# Altium schematic sheet STP_MAX96724_PINOUT.SchDoc
size D; SheetNumber: 4; SheetTotal: 19
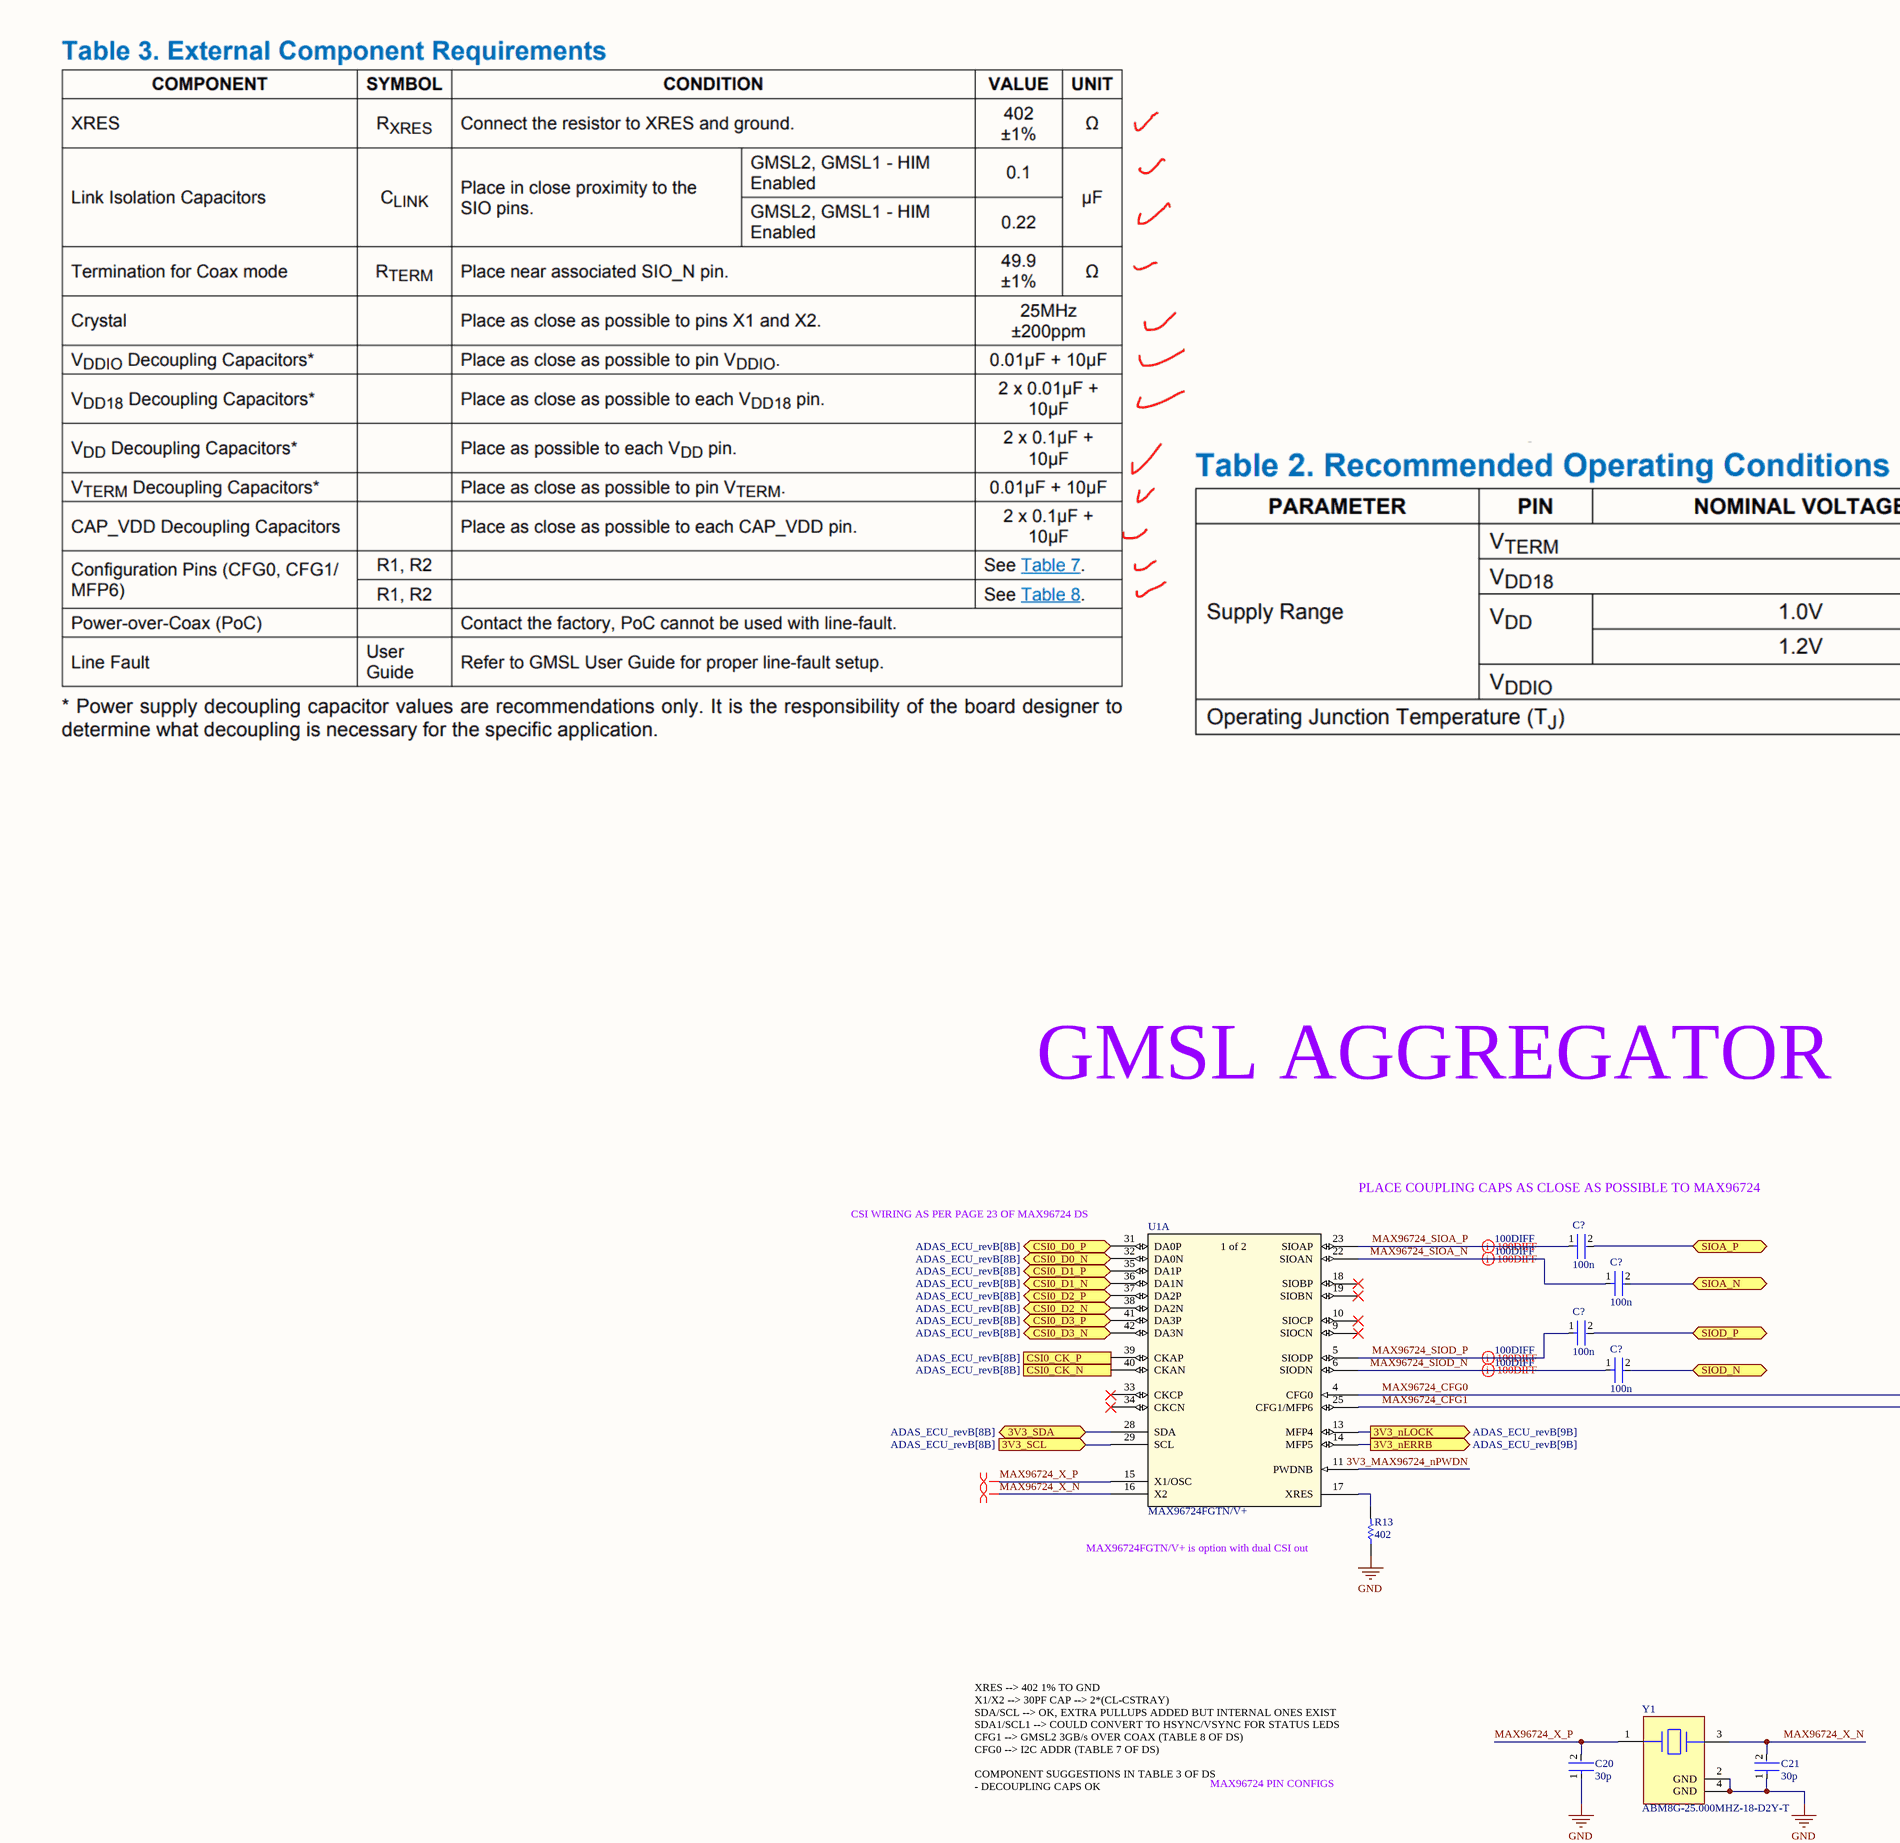
[diagram p0: STP_MAX96724_PINOUT.SchDoc, top left]
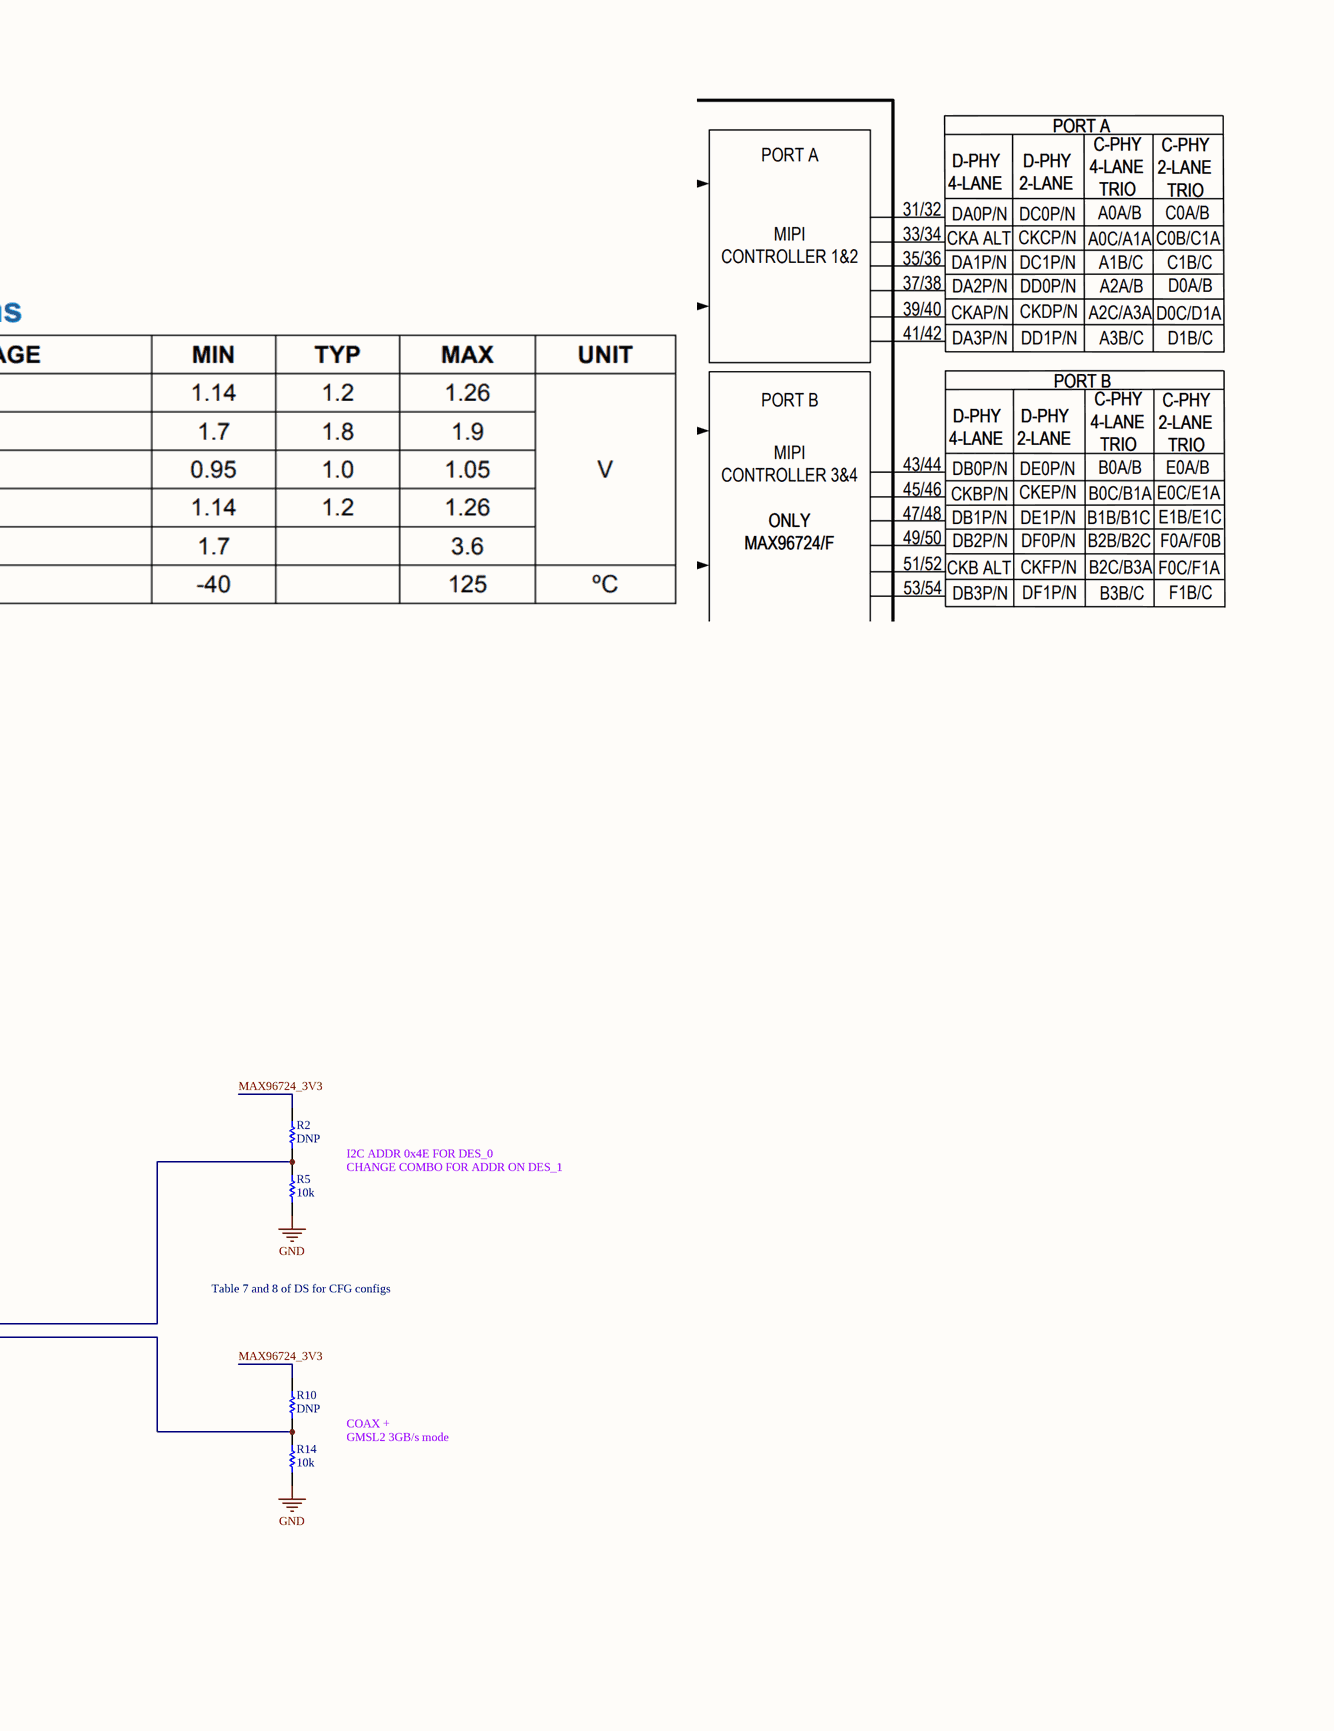
[diagram p1: STP_MAX96724_PINOUT.SchDoc, top right]
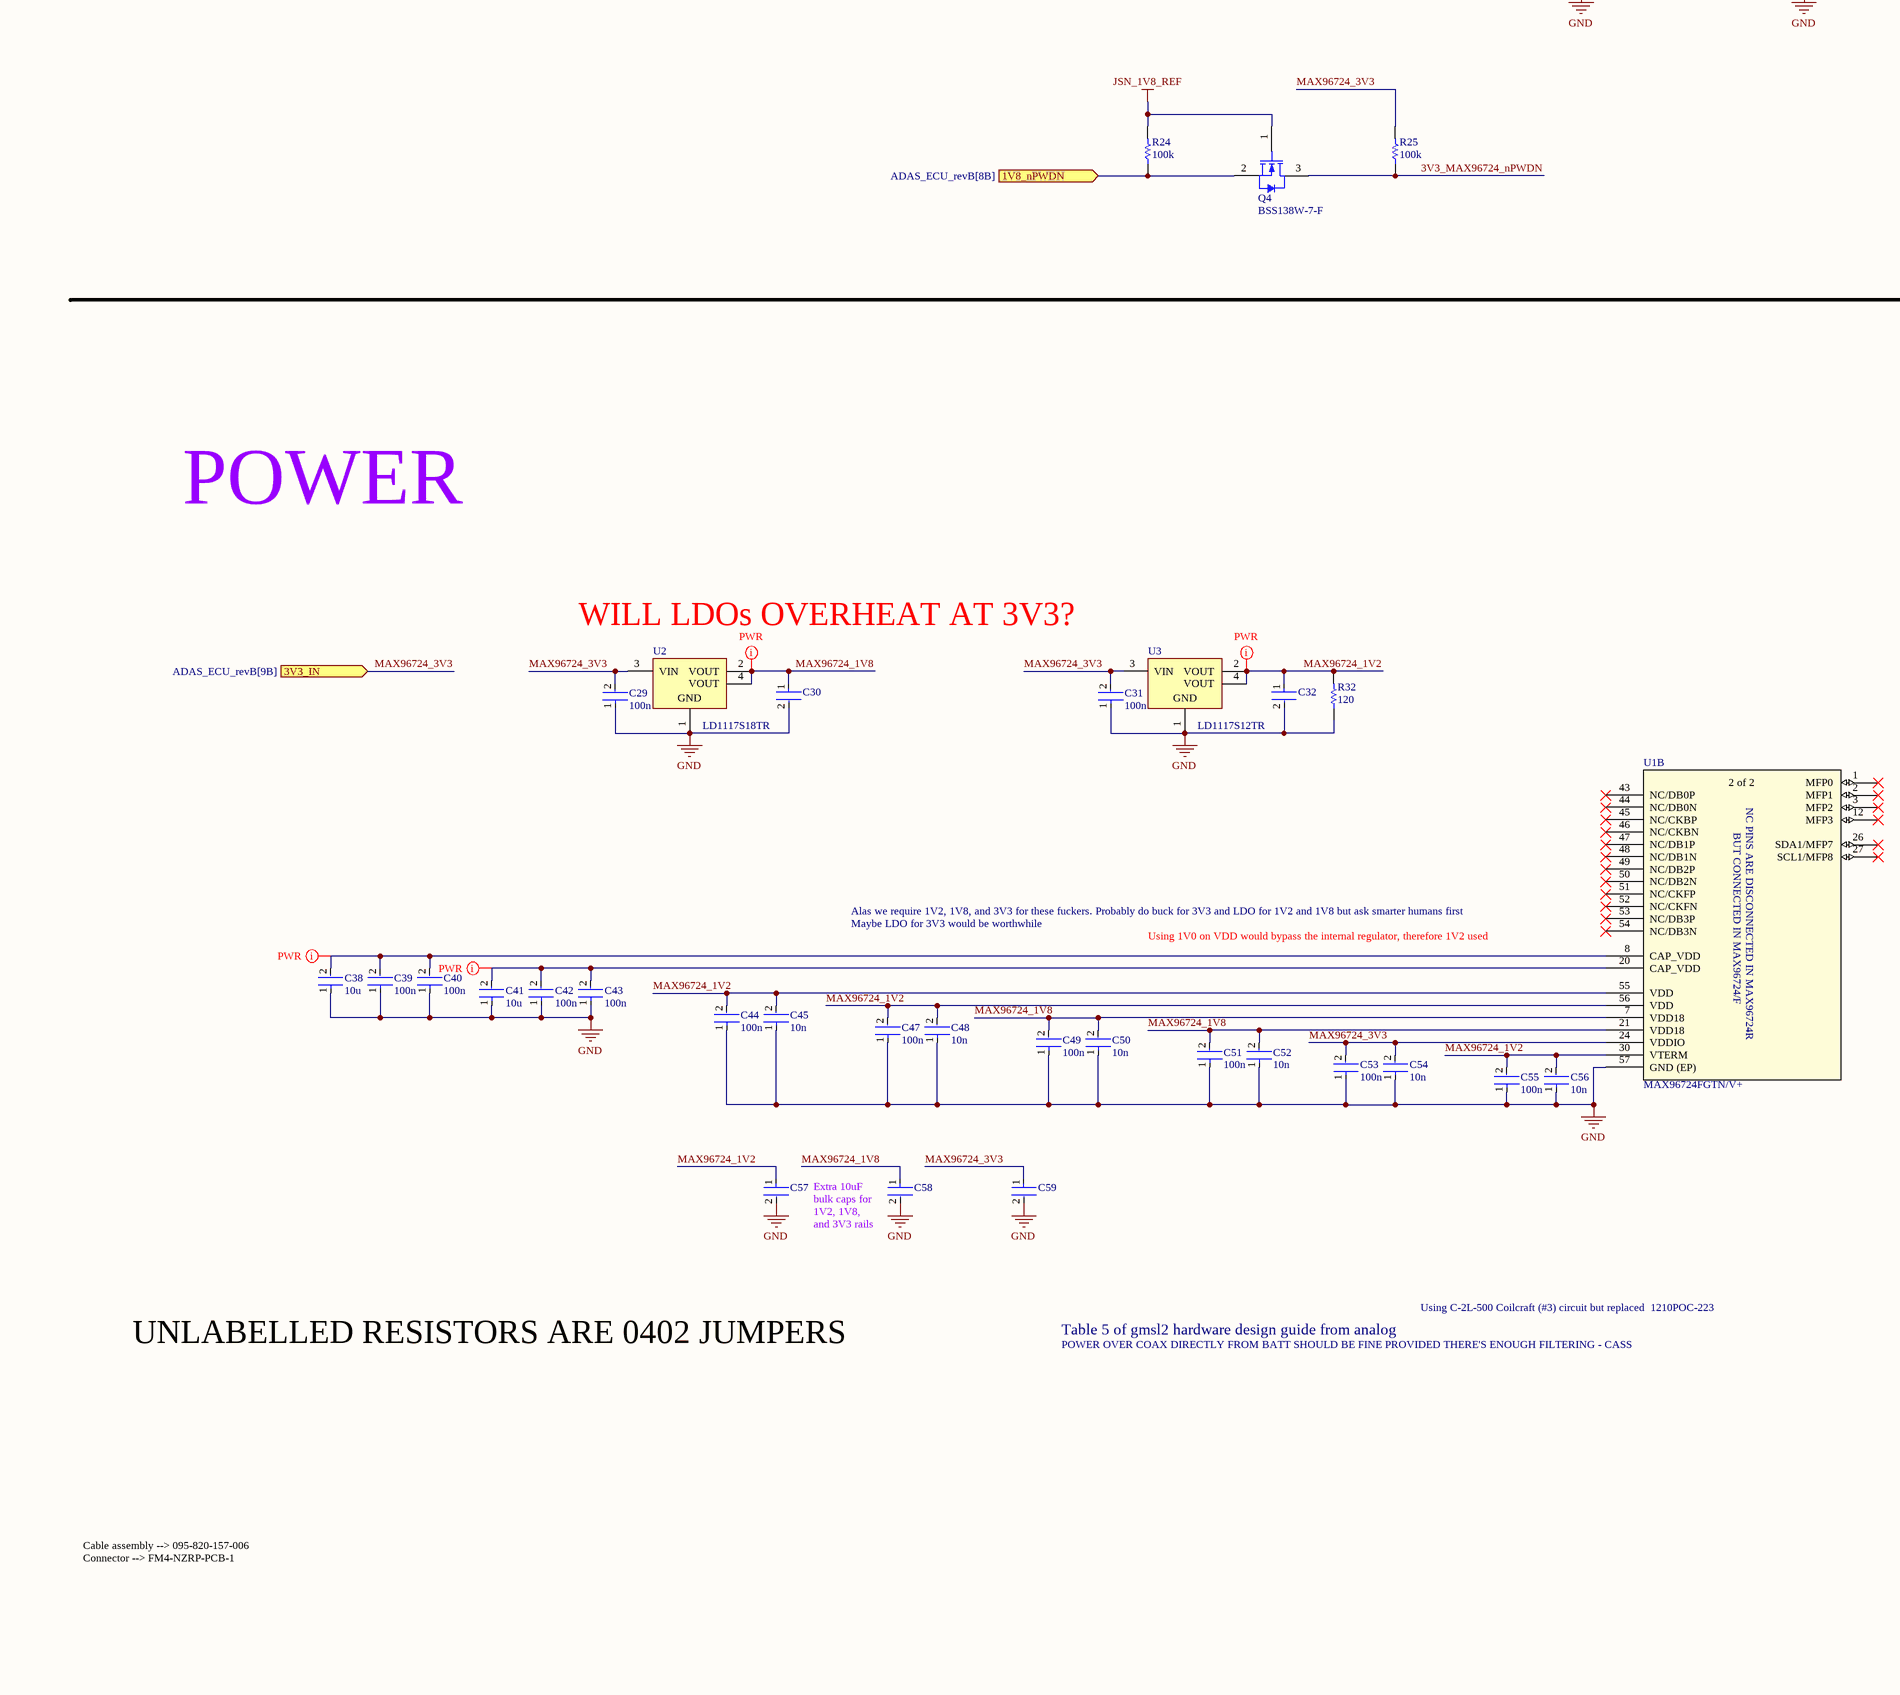
[diagram p2: STP_MAX96724_PINOUT.SchDoc, bottom left]
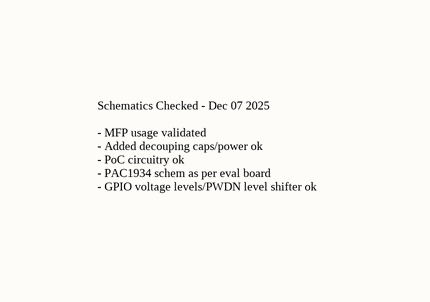
[diagram p3: STP_MAX96724_PINOUT.SchDoc, bottom right]

## Parts
(Parts that share a designator on the sheet are numbered #1, #2 ... from top to bottom, then left to right.)
C20  30p  [FP-0402-L_1_0_0_05-W_0_5-IPC_A]
C21  30p  [FP-0402-L_1_0_0_05-W_0_5-IPC_A]
C29  100n  [FP-0402-L_1_0_0_05-W_0_5-IPC_A]
C30  GRM188R60J106ME47D  [FP-GRM188-0_1-e0_2_0_55-IPC_A]  (value not drawn)
C31  100n  [FP-0402-L_1_0_0_05-W_0_5-IPC_A]
C32  GRM188R60J106ME47D  [FP-GRM188-0_1-e0_2_0_55-IPC_A]  (value not drawn)
C38  10u  [FP-0402-L_1_0_0_05-W_0_5-IPC_A]
C39  100n  [FP-0402-L_1_0_0_05-W_0_5-IPC_A]
C40  100n  [FP-0402-L_1_0_0_05-W_0_5-IPC_A]
C41  10u  [FP-0402-L_1_0_0_05-W_0_5-IPC_A]
C42  100n  [FP-0402-L_1_0_0_05-W_0_5-IPC_A]
C43  100n  [FP-0402-L_1_0_0_05-W_0_5-IPC_A]
C44  100n  [FP-0402-L_1_0_0_05-W_0_5-IPC_A]
C45  10n  [FP-0402-L_1_0_0_05-W_0_5-IPC_A]
C47  100n  [FP-0402-L_1_0_0_05-W_0_5-IPC_A]
C48  10n  [FP-0402-L_1_0_0_05-W_0_5-IPC_A]
C49  100n  [FP-0402-L_1_0_0_05-W_0_5-IPC_A]
C50  10n  [FP-0402-L_1_0_0_05-W_0_5-IPC_A]
C51  100n  [FP-0402-L_1_0_0_05-W_0_5-IPC_A]
C52  10n  [FP-0402-L_1_0_0_05-W_0_5-IPC_A]
C53  100n  [FP-0402-L_1_0_0_05-W_0_5-IPC_A]
C54  10n  [FP-0402-L_1_0_0_05-W_0_5-IPC_A]
C55  100n  [FP-0402-L_1_0_0_05-W_0_5-IPC_A]
C56  10n  [FP-0402-L_1_0_0_05-W_0_5-IPC_A]
C57  EMK107BBJ106MA-T  [FP-0603-L_1_6_0_2-W_0_8_0-MFG]  (value not drawn)
C58  EMK107BBJ106MA-T  [FP-0603-L_1_6_0_2-W_0_8_0-MFG]  (value not drawn)
C59  EMK107BBJ106MA-T  [FP-0603-L_1_6_0_2-W_0_8_0-MFG]  (value not drawn)
C?#1  100n  [FP-0402-L_1_0_0_05-W_0_5-IPC_A]
C?#2  100n  [FP-0402-L_1_0_0_05-W_0_5-IPC_A]
C?#3  100n  [FP-0402-L_1_0_0_05-W_0_5-IPC_A]
C?#4  100n  [FP-0402-L_1_0_0_05-W_0_5-IPC_A]
Q4  BSS138W-7-F  [DIOD-SOT323-3_V]
R2  DNP  [R0603B]
R5  10k  [R0603B]
R10  DNP  [R0603B]
R13  402  [R0603B]
R14  10k  [R0603B]
R24  100k  [R0603B]
R25  100k  [R0603B]
R32  120  [R0603B]
U1  MAX96724FGTN/V+  [MAX96724FGTN_V+-Footprint-1]  (parts A,B of 2)
U2  LD1117S18TR  [SOT-223_M]
U3  LD1117S12TR  [SOT-223_M]
Y1  ABM8G-25.000MHZ-18-D2Y-T  [FP-ABM8G-MFG]

## Ports
1V8_nPWDN (in, see ADAS_ECU_revB[8B]), 3V3_IN (in, see ADAS_ECU_revB[9B]), 3V3_nERRB (out, see ADAS_ECU_revB[9B]), 3V3_nLOCK (out, see ADAS_ECU_revB[9B]), 3V3_SCL (in, see ADAS_ECU_revB[8B]), 3V3_SDA (bidir, see ADAS_ECU_revB[8B]), CSI0_CK_N (in, see ADAS_ECU_revB[8B]), CSI0_CK_P (in, see ADAS_ECU_revB[8B]), CSI0_D0_N (bidir, see ADAS_ECU_revB[8B]), CSI0_D0_P (bidir, see ADAS_ECU_revB[8B]), CSI0_D1_N (bidir, see ADAS_ECU_revB[8B]), CSI0_D1_P (bidir, see ADAS_ECU_revB[8B]), CSI0_D2_N (bidir, see ADAS_ECU_revB[8B]), CSI0_D2_P (bidir, see ADAS_ECU_revB[8B]), CSI0_D3_N (bidir, see ADAS_ECU_revB[8B]), CSI0_D3_P (bidir, see ADAS_ECU_revB[8B]), SIOA_N (bidir), SIOA_P (bidir), SIOD_N (bidir), SIOD_P (bidir)

## Nets
GND: C20.1 C21.1 C29.1 C30.2 C31.1 C32.2 C38.1 C39.1 C40.1 C41.1 C42.1 C43.1 C44.1 C45.1 C47.1 C48.1 C49.1 C50.1 C51.1 C52.1 C53.1 C54.1 C55.1 C56.1 C57.2 C58.2 C59.2 R5.1 R13.1 R14.1 R32.1 U1.57(GND_(EP)) U2.1(GND) U3.1(GND) Y1.2(GND) Y1.4(GND)
JSN_1V8_REF: Q4.1(G) R24.2
1V8_nPWDN: Q4.2(S) R24.1 ; port 1V8_nPWDN
3V3_MAX96724_nPWDN: Q4.3(D) R25.1 U1.11(PWDNB)
3V3_nERRB: U1.14(MFP5) ; port 3V3_nERRB
3V3_nLOCK: U1.13(MFP4) ; port 3V3_nLOCK
3V3_SCL: U1.29(SCL) ; port 3V3_SCL
3V3_SDA: U1.28(SDA) ; port 3V3_SDA
CSI0_CK_N: U1.40(CKAN) ; port CSI0_CK_N
CSI0_CK_P: U1.39(CKAP) ; port CSI0_CK_P
CSI0_D0_N: U1.32(DA0N) ; port CSI0_D0_N
CSI0_D0_P: U1.31(DA0P) ; port CSI0_D0_P
CSI0_D1_N: U1.36(DA1N) ; port CSI0_D1_N
CSI0_D1_P: U1.35(DA1P) ; port CSI0_D1_P
CSI0_D2_N: U1.38(DA2N) ; port CSI0_D2_N
CSI0_D2_P: U1.37(DA2P) ; port CSI0_D2_P
CSI0_D3_N: U1.42(DA3N) ; port CSI0_D3_N
CSI0_D3_P: U1.41(DA3P) ; port CSI0_D3_P
MAX96724_1V2: C32.1 C44.2 C45.2 C47.2 C48.2 C55.2 C56.2 C57.1 R32.2 U1.30(VTERM) U1.55(VDD) U1.56(VDD) U3.2(VOUT) U3.4(VOUT)
MAX96724_1V8: C30.1 C49.2 C50.2 C51.2 C52.2 C58.1 U1.7(VDD18) U1.21(VDD18) U2.2(VOUT) U2.4(VOUT)
MAX96724_3V3: C29.2 C31.2 C53.2 C54.2 C59.1 R2.2 R10.2 R25.2 U1.24(VDDIO) U2.3(VIN) U3.3(VIN) ; port 3V3_IN
MAX96724_CFG0: R2.1 R5.2 U1.4(CFG0)
MAX96724_CFG1: R10.1 R14.2 U1.25(CFG1/MFP6)
MAX96724_SIOA_N: C?#2.1 U1.22(SIOAN)
MAX96724_SIOA_P: C?#1.1 U1.23(SIOAP)
MAX96724_SIOD_N: C?#4.1 U1.6(SIODN)
MAX96724_SIOD_P: C?#3.1 U1.5(SIODP)
MAX96724_X_N: C21.2 U1.16(X2) Y1.3
MAX96724_X_P: C20.2 U1.15(X1/OSC) Y1.1
SIOA_N: C?#2.2 ; port SIOA_N
SIOA_P: C?#1.2 ; port SIOA_P
SIOD_N: C?#4.2 ; port SIOD_N
SIOD_P: C?#3.2 ; port SIOD_P
NetC38_2: C38.2 C39.2 C40.2 U1.8(CAP_VDD)
NetC41_2: C41.2 C42.2 C43.2 U1.20(CAP_VDD)
NetR13_2: R13.2 U1.17(XRES)

Not connected (* = marked no-connect by the designer): U1 1(MFP0)* 2(MFP1)* 3(MFP2)* 9(SIOCN)* 10(SIOCP)* 12(MFP3)* 18(SIOBP)* 19(SIOBN)* 26(SDA1/MFP7)* 27(SCL1/MFP8)* 33(CKCP)* 34(CKCN)* 43(NC/DB0P)* 44(NC/DB0N)* 45(NC/CKBP)* 46(NC/CKBN)* 47(NC/DB1P)* 48(NC/DB1N)* 49(NC/DB2P)* 50(NC/DB2N)* 51(NC/CKFP)* 52(NC/CKFN)* 53(NC/DB3P)* 54(NC/DB3N)*

## Layout directives
differential pair: MAX96724_X_N, MAX96724_X_P
differential pair; differential pair class 100DIFF: MAX96724_SIOA_N, MAX96724_SIOA_P, MAX96724_SIOD_N, MAX96724_SIOD_P
net class PWR: MAX96724_1V2, MAX96724_1V8, NetC38_2, NetC41_2

## Notes on the sheet
- GMSL AGGREGATOR
- PLACE COUPLING CAPS AS CLOSE AS POSSIBLE TO MAX96724
- CSI WIRING AS PER PAGE 23 OF MAX96724 DS
- I2C ADDR 0x4E FOR DES_0
- CHANGE COMBO FOR ADDR ON DES_1
- Table 7 and 8 of DS for CFG configs
- GMSL2 3GB/s mode
- COAX +
- MAX96724FGTN/V+ is option with dual CSI out
- XRES --> 402 1% TO GND
  X1/X2 --> 30PF CAP --> 2*(CL-CSTRAY)
  SDA/SCL --> OK, EXTRA PULLUPS ADDED BUT INTERNAL ONES EXIST
  SDA1/SCL1 --> COULD CONVERT TO HSYNC/VSYNC FOR STATUS LEDS
  CFG1 --> GMSL2 3GB/s OVER COAX (TABLE 8 OF DS)
  CFG0 --> I2C ADDR (TABLE 7 OF DS)
  COMPONENT SUGGESTIONS IN TABLE 3 OF DS
  - DECOUPLING CAPS OK
- MAX96724 PIN CONFIGS
- POWER
- WILL LDOs OVERHEAT AT 3V3?
- Alas we require 1V2, 1V8, and 3V3 for these fuckers. Probably do buck for 3V3 and LDO for 1V2 and 1V8 but ask smarter humans first
- Maybe LDO for 3V3 would be worthwhile
- Using 1V0 on VDD would bypass the internal regulator, therefore 1V2 used
- Extra 10uF bulk caps for 1V2, 1V8, and 3V3 rails
- Using C-2L-500 Coilcraft (#3) circuit but replaced  1210POC-223
- UNLABELLED RESISTORS ARE 0402 JUMPERS
- Table 5 of gmsl2 hardware design guide from analog
- POWER OVER COAX DIRECTLY FROM BATT SHOULD BE FINE PROVIDED THERE'S ENOUGH FILTERING - CASS
- Schematics Checked - Dec 07 2025
  - MFP usage validated
  - Added decouping caps/power ok
  - PoC circuitry ok
  - PAC1934 schem as per eval board
  - GPIO voltage levels/PWDN level shifter ok
- Cable assembly --> 095-820-157-006
  Connector --> FM4-NZRP-PCB-1
- (in symbol CMP-015-00011-4, part A) 1 of 2
- (in symbol CMP-015-00011-4, part B) 2 of 2; NC PINS ARE DISCONNECTED IN MAX96724R; BUT CONNECTED IN MAX96724/F

## Library data of the parts
C20 C21 C29 C31 C38-C45 C47-C56 C?#1-C?#4 = CMP-001-00058-1: LARGE PADS, 0402 CAP, CHANGE COMMENT TO MATCH REAL P/N; Capacitor Type: Ceramic; Min Operating Temperature: -55°C; Mounting Technology: Surface Mount; Pins: 2; Case/Package: 0402; RoHS Compliant: Yes; Max Operating Temperature: 85°C
C30 C32 = CMP-2006-02792-2: Chip Multilayer Ceramic Capacitors for General Purpose, 0603, 10uF, X5R, 15%, 20%, 6.3V; Packaging: Tape and Reel; Voltage Rating (DC): 6.3V; Width: 0.031inch; Termination: SMD/SMT; Dielectric: X5R; Package Quantity: 4000; Voltage Rating: 6.3V; Capacitance: 10uF; Case/Package: 0603; Min Operating Temperature: -55°C; Voltage: 6.3V; Length: 1.6mm; Thickness: 0.035inch; Lead Free: Lead Free; Depth: 0.8mm; Case Code (Imperial): 0603; Max Operating Temperature: 85°C; Material: Ceramic; Height: 0.8mm; Tolerance: 20%; Mount: Surface Mount; REACH SVHC: No SVHC; Radiation Hardening: No; Case Code (Metric): 1608
C57-C59 = CMP-2000-06226-4: Multilayer Ceramic Capacitor 10uF 16V X5R 20% SMD 0603 T/R; Packaging: Tape and Reel; Construction: Flat; Height: 0.8mm; Max Operating Temperature: 85°C; Dielectric: X5R; Case Code (Metric): 1608; Voltage Rating (DC): 16V; Width: 0.031inch; Voltage Rating: 16V; Length: 0.063inch; RoHS Compliant: Yes; Halogen Free: Halogen Free; Case Code (Imperial): 0603; Capacitance: 10uF; Mount: Surface Mount; Thickness: 0.031inch; Tolerance: 20%; Min Operating Temperature: -55°C; Series: M; Termination: SMD/SMT; Case/Package: 0603; Package Quantity: 1
Q4 = CMP-2000-05968-1: N-Channel Enhancement Mode Mosfet, 50 V, 200 mA, -55 to 150 degC, 6-Pin SOT-323, RoHS, Tape and Reel; Typical Turn-Off Delay Time: 20ns; Number of Channels: 1Channel; Type: EnhancementModeFieldEffectTransistor; Brand: DiodesIncorporated; Vds - Drain-Source Breakdown Voltage: 75V; Vgs - Gate-Source Voltage: 20V; Rds On - Drain-Source Resistance: 1.4Ohms; Transistor Type: 1N-Channel; Configuration: Single; Unit Weight: 0.000212oz; Pd - Power Dissipation: 200mW; Id - Continuous Drain Current: 200mA; Forward Transconductance - Min: 0.1S; Manufacturer URL: http://www.diodes.com/; Series: BSS138; Package Description: 3-Pin Small Outline Transistor, Body 2 x 1.25 mm, Pitch 0.65 mm; Mounting Technology: SurfaceMount; Product Category: MOSFET; RoHS: True; Maximum Operating Temperature: +150C; Height: 1mm; Length: 2.2mm; Technology: Si; Width: 1.35mm; Datasheet URL: http://www.diodes.com/_files/datasheets/ds30206.pdf; Manufacturer: DiodesIncorporated; Package / Case: SOT-323-3; Typical Turn-On Delay Time: 20ns; Transistor Polarity: N-Channel; Factory Pack Quantity: 3000; Packaging: Reel; Product: MOSFETSmallSignal; Datasheet Version: Rev. 11-2, 09/2013; Package Reference: SOT323; Minimum Operating Temperature: -55C; Mounting Style: SMD/SMT; Channel Mode: Enhancement
R2 R5 R10 R13 R14 R24 R25 R32 = CMP-009-00002-14: Resistor
U1 = CMP-015-00011-4: Quad Tunneling GMSL2/1 to CSI-2 Deserializer
U2 = CMP-0244-00308-1: Fixed Low Drop Positive Voltage Regulator, 1.8V, 4-Pin SOT-223, Tape and Reel; ComponentLink1URL: http://www.st.com; PackageReference: SOT-223; PackageDescription: 4-Pin SOT-223 Package, 6.5 x 3.5 mm Body, 2.3 mm Pitch, 7 mm Lead Span; ComponentLink2URL: http://www.st.com/internet/com/TECHNICAL_RESOURCES/TECHNICAL_LITERATURE/DATASHEET/CD00000544.pdf; ComponentLink2Description: Datasheet; ComponentLink1Description: Manufacturer URL; DatasheetVersion: 1/11/2011; PackageVersion: 2010
U3 = CMP-0244-00318-1: Fixed Low Drop Positive Voltage Regulator, 1.2V, 4-Pin SOT-223, Tape and Reel; PackageDescription: 4-Pin SOT-223 Package, 6.5 x 3.5 mm Body, 2.3 mm Pitch, 7 mm Lead Span; PackageVersion: 2010; ComponentLink2Description: Datasheet; PackageReference: SOT-223; ComponentLink2URL: http://www.st.com/internet/com/TECHNICAL_RESOURCES/TECHNICAL_LITERATURE/DATASHEET/CD00000544.pdf; ComponentLink1Description: Manufacturer URL; DatasheetVersion: 1/11/2011; ComponentLink1URL: http://www.st.com
Y1 = CMP-2000-05733-3: Crystal 25MHz ±20ppm (Tol) ±30ppm (Stability) 18pF FUND 60Ω 4-Pin SMD T/R; Series Resistance: 60R; Length: 3.2mm; Depth: 2.5mm; Packaging: Tape and Reel; Min Operating Temperature: -40°C; Operating Frequency: 25 MHz; Lead Free: Lead Free; Number of Pins: 4; Frequency Tolerance: 20ppm; Radiation Hardening: No; Max Operating Temperature: 85°C; Termination: SMD/SMT; Frequency Stability: 30ppm; Frequency: 25MHz; Series: ABM8G; Mount: Surface Mount; Package Quantity: 1000; Height: 0.039inch; Width: 0.098inch; Case/Package: CSMD; ESR (Equivalent Series Resistance): 60R; Load Capacitance: 18pF; Tolerance: 20ppm